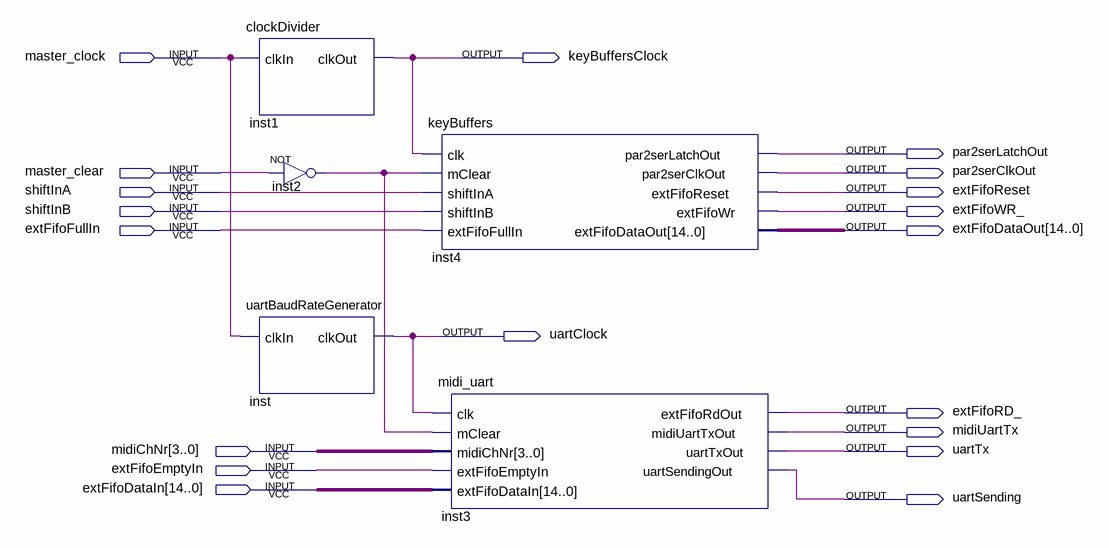
[diagram p0: schematic sheet]
// Quartus schematic Main_wo_debug.bdf as structural Verilog: 5 symbols, 19 pins
module Main_wo_debug (
  input  master_clock,
  input  master_clear,
  input  shiftInA,
  input  shiftInB,
  input  extFifoFullIn,
  input  [3:0] midiChNr,
  input  extFifoEmptyIn,
  input  [14:0] extFifoDataIn,
  output keyBuffersClock,
  output par2serLatchOut,
  output par2serClkOut,
  output extFifoReset,
  output extFifoWR_,
  output [14:0] extFifoDataOut,
  output uartClock,
  output extFifoRD_,
  output midiUartTx,
  output uartTx,
  output uartSending
);

  wire inst2_out;

  clockDivider inst1 (.clkIn(master_clock), .clkOut(keyBuffersClock));
  not inst2 (inst2_out, master_clear);
  uartBaudRateGenerator inst (.clkIn(master_clock), .clkOut(uartClock));
  keyBuffers inst4 (
    .clk(keyBuffersClock), .mClear(inst2_out), .shiftInA(shiftInA), .shiftInB(shiftInB),
    .extFifoFullIn(extFifoFullIn), .par2serLatchOut(par2serLatchOut), .par2serClkOut(par2serClkOut),
    .extFifoReset(extFifoReset), .extFifoWr(extFifoWR_), .extFifoDataOut(extFifoDataOut));
  midi_uart inst3 (
    .clk(uartClock), .mClear(inst2_out), .midiChNr(midiChNr), .extFifoEmptyIn(extFifoEmptyIn),
    .extFifoDataIn(extFifoDataIn), .extFifoRdOut(extFifoRD_), .midiUartTxOut(midiUartTx), .uartTxOut(uartTx),
    .uartSendingOut(uartSending));
endmodule
